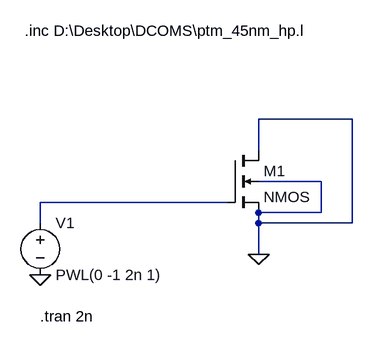
[diagram p0: schematic Cgs.asc]
Cgs.asc, the LTspice schematic file:
Version 4
SHEET 1 880 680
WIRE 352 64 208 64
WIRE 208 112 208 64
WIRE 304 160 208 160
WIRE 160 192 -128 192
WIRE 304 208 304 160
WIRE 304 208 208 208
WIRE -128 224 -128 192
WIRE 208 224 208 208
WIRE 352 224 352 64
WIRE 352 224 208 224
WIRE 208 272 208 224
FLAG 208 272 0
FLAG -128 304 0
SYMBOL nmos4 160 112 R0
SYMATTR InstName M1
SYMATTR Value2 l=1u w=360n
SYMBOL voltage -128 208 R0
SYMATTR InstName V1
SYMATTR Value PWL(0 -1 2n 1)
TEXT -128 368 Left 2 !.tran 2n
TEXT -152 -72 Left 2 !.inc D:\\Desktop\\DCOMS\\ptm_45nm_hp.l

The netlist it stands for:
* Cgs.asc
M1 0 N001 0 0 NMOS l=1u w=360n
V1 N001 0 PWL(0 -1 2n 1)
.model NMOS NMOS
.model PMOS PMOS
.lib standard.mos
.tran 2n
.inc D:\Desktop\DCOMS\ptm_45nm_hp.l
.backanno
.end